# Altium schematic sheet Top.SchDoc: Top Level
size A3; CompanyName: NOT USED; DocumentNumber: 5; SheetNumber: 5; SheetTotal: 5; PageSetup: Record=PageOptions|CenterHorizontal=True|CenterVertical=True|PrintScale=1.00|XCorrection=1.00|YCorrection=1.00|PrintKind=0|BorderSize=5000000|LeftOffset=0|BottomOffset=0|Orientation=2|PaperLength=1000|PaperWidth=1000|Scale=100|PaperSource=7|PrintQuality=-4|MediaType=1|DitherType=10|PaperKind=A3|PrintScaleMode=0
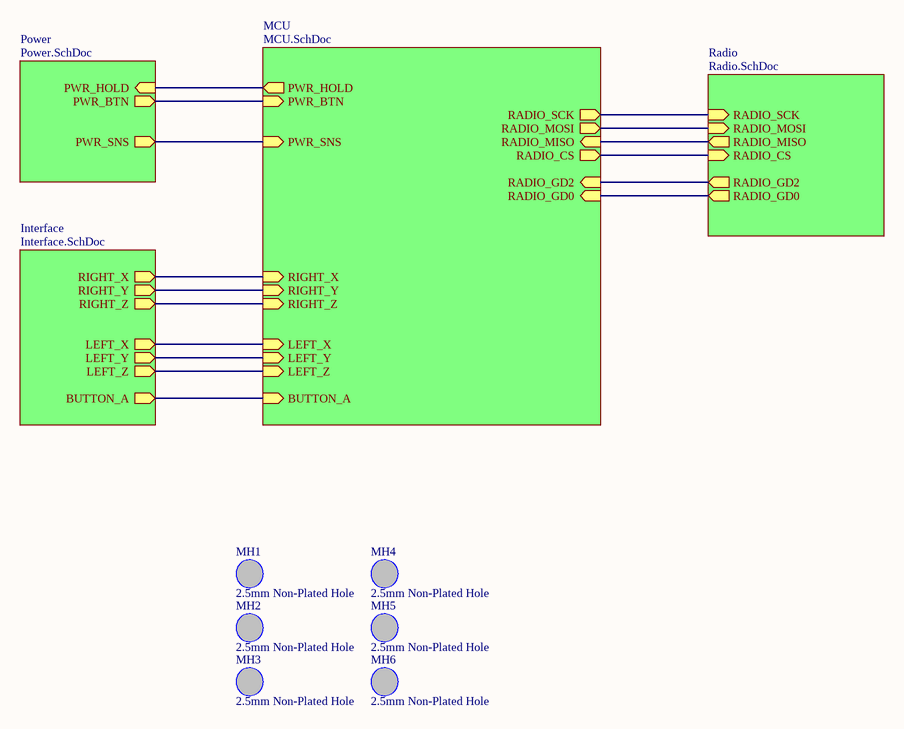
[diagram p0: Top.SchDoc]

## Parts
MH1  2.5mm Non-Plated Hole  [MTG250X550]  (no BOM)
MH2  2.5mm Non-Plated Hole  [MTG250X550]  (no BOM)
MH3  2.5mm Non-Plated Hole  [MTG250X550]  (no BOM)
MH4  2.5mm Non-Plated Hole  [MTG250X550]  (no BOM)
MH5  2.5mm Non-Plated Hole  [MTG250X550]  (no BOM)
MH6  2.5mm Non-Plated Hole  [MTG250X550]  (no BOM)

## Sub-sheets
Interface = Interface.SchDoc: RIGHT_X (out), RIGHT_Z (out), RIGHT_Y (out), LEFT_X (out), LEFT_Y (out), LEFT_Z (out), BUTTON_A (out)
MCU = MCU.SchDoc: RADIO_SCK (out), RADIO_MOSI (out), LEFT_Y (in), RIGHT_Y (in), RADIO_MISO (in), RIGHT_Z (in), LEFT_Z (in), RIGHT_X (in), LEFT_X (in), RADIO_CS (out), PWR_HOLD (out), BUTTON_A (in), PWR_SNS (in), PWR_BTN (in), RADIO_GD2 (in), RADIO_GD0 (in)
Power = Power.SchDoc: PWR_HOLD (in), PWR_BTN (out), PWR_SNS (out)
Radio = Radio.SchDoc: RADIO_GD2 (out), RADIO_GD0 (out), RADIO_SCK (in), RADIO_CS (in), RADIO_MOSI (in), RADIO_MISO (out)

## Nets
(unnamed): sheet Power/PWR_HOLD, sheet MCU/PWR_HOLD
(unnamed): sheet Power/PWR_BTN, sheet MCU/PWR_BTN
(unnamed): sheet Power/PWR_SNS, sheet MCU/PWR_SNS
(unnamed): sheet Interface/RIGHT_X, sheet MCU/RIGHT_X
(unnamed): sheet Interface/RIGHT_Z, sheet MCU/RIGHT_Z
(unnamed): sheet Interface/RIGHT_Y, sheet MCU/RIGHT_Y
(unnamed): sheet Interface/LEFT_X, sheet MCU/LEFT_X
(unnamed): sheet Interface/LEFT_Y, sheet MCU/LEFT_Y
(unnamed): sheet Interface/LEFT_Z, sheet MCU/LEFT_Z
(unnamed): sheet Interface/BUTTON_A, sheet MCU/BUTTON_A
(unnamed): sheet MCU/RADIO_SCK, sheet Radio/RADIO_SCK
(unnamed): sheet MCU/RADIO_MOSI, sheet Radio/RADIO_MOSI
(unnamed): sheet MCU/RADIO_MISO, sheet Radio/RADIO_MISO
(unnamed): sheet MCU/RADIO_CS, sheet Radio/RADIO_CS
(unnamed): sheet MCU/RADIO_GD2, sheet Radio/RADIO_GD2
(unnamed): sheet MCU/RADIO_GD0, sheet Radio/RADIO_GD0

## Notes on the sheet
- Project
- Size:
- Date:
- A3
- Revision:
- Sheet
- of
- Lambo
- File:

## Library data of the parts
MH1-MH6 = NONPART-007: Display_Name: 2.5mm Non-Plated Hole; BWA PN: NONPART-007; Schematic Symbol: HOLE_UNPLATED